# Altium schematic sheet Sheet1.SchDoc
size A3; SheetNumber: 1; SheetTotal: 1
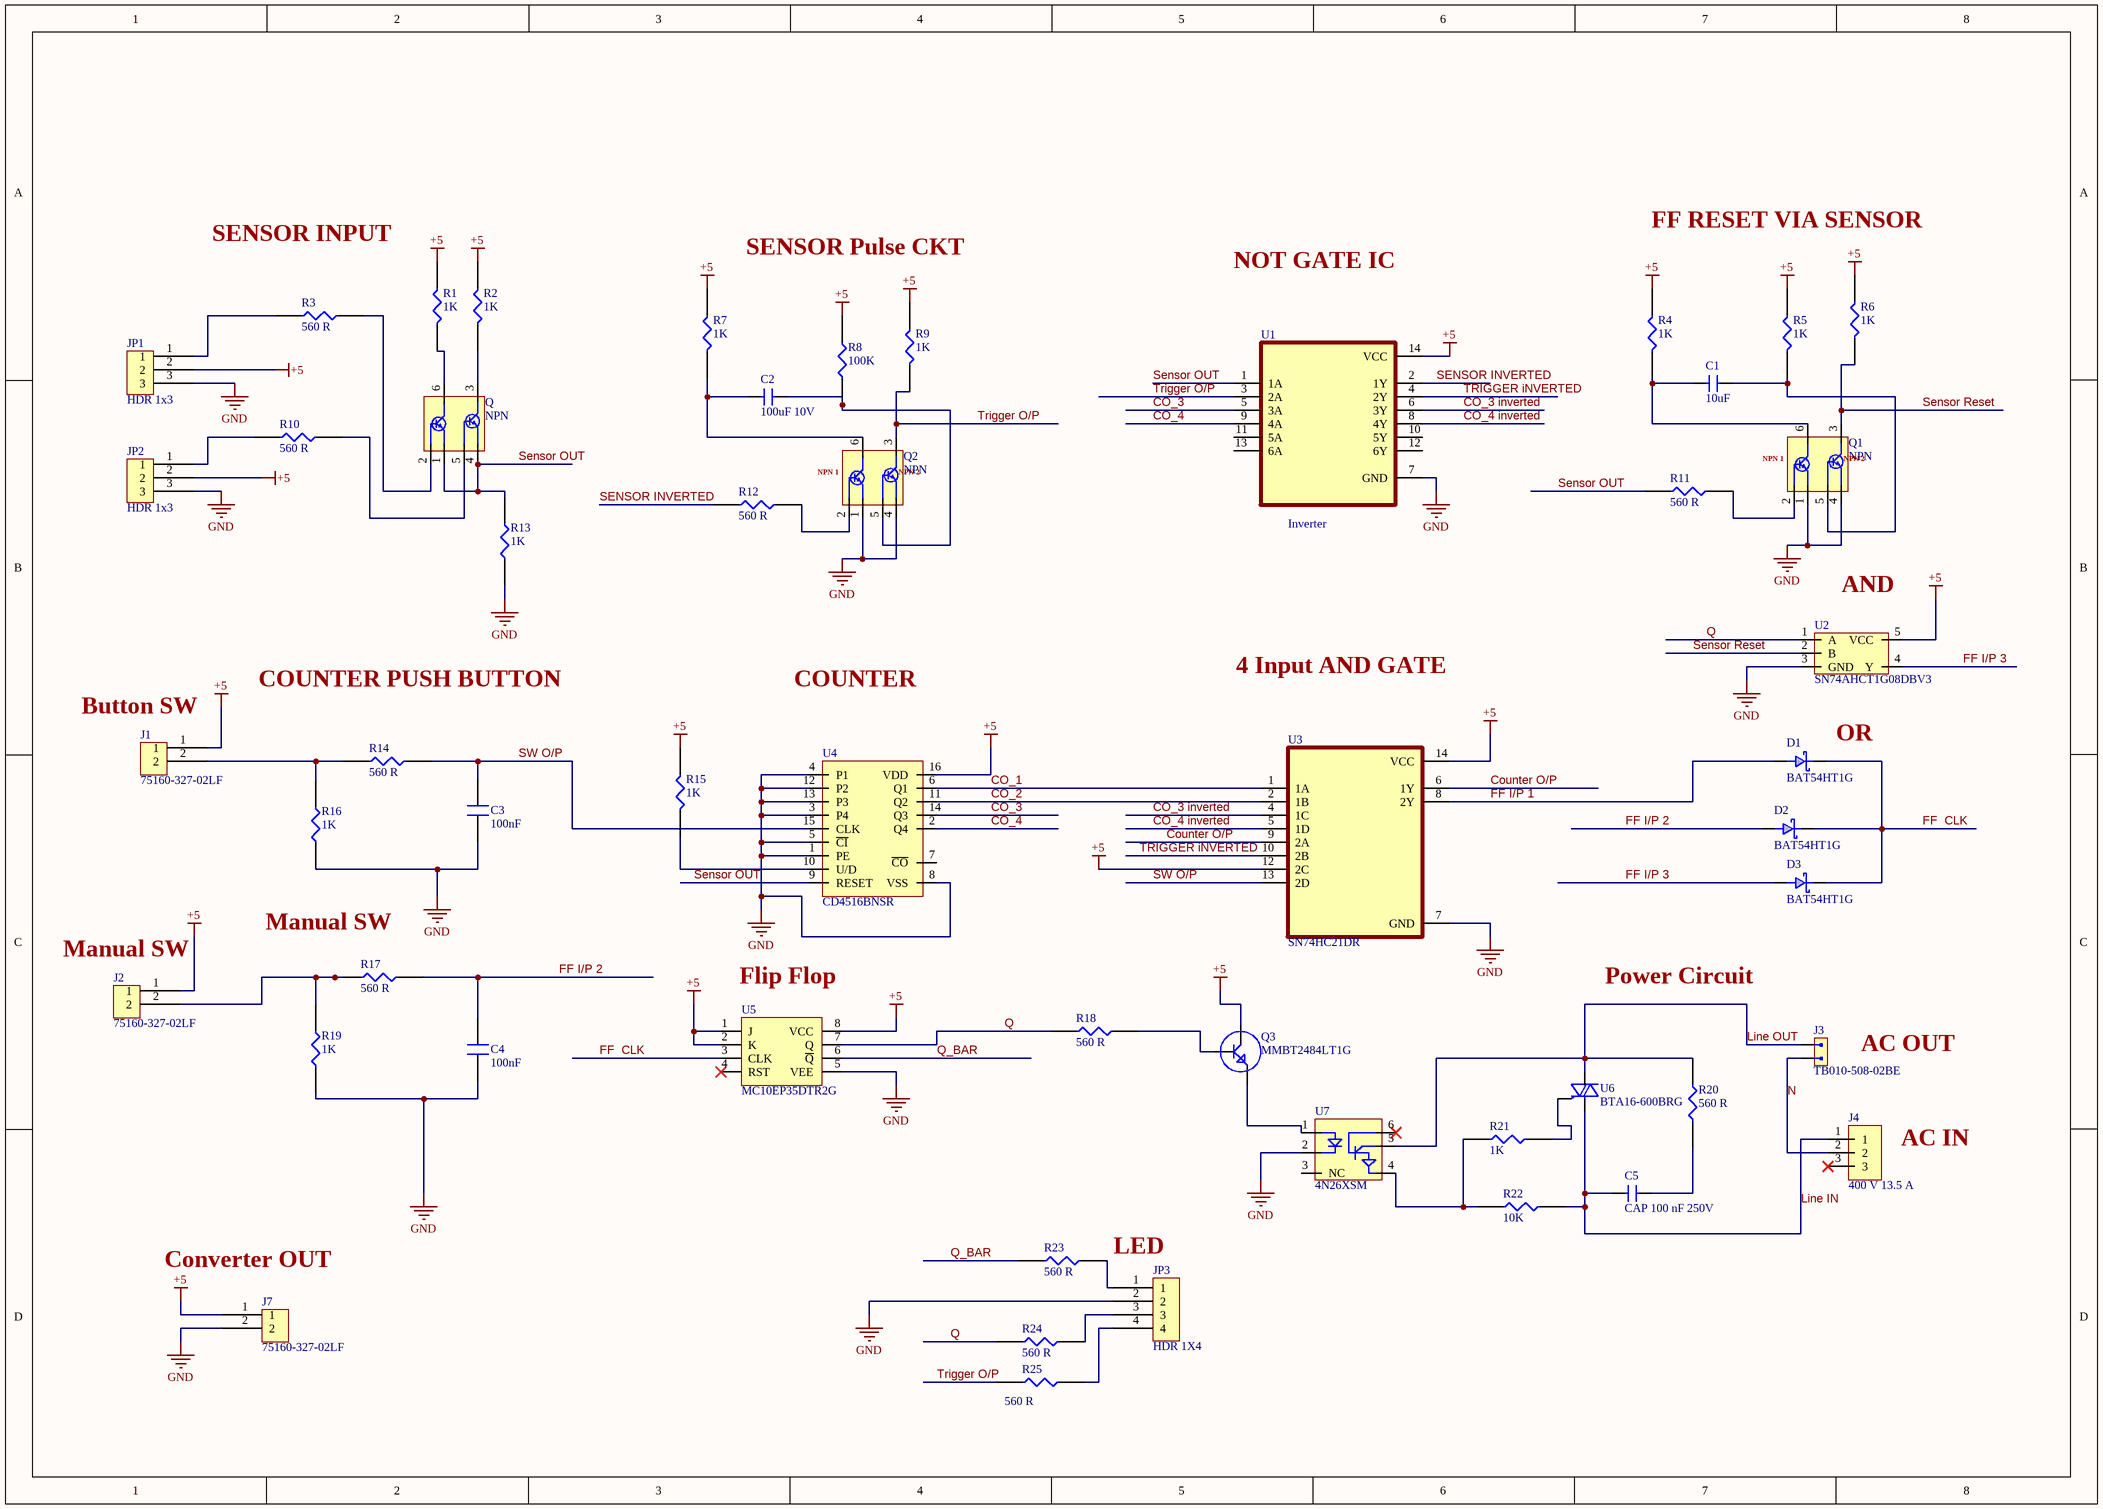
[diagram p0: Sheet1.SchDoc]

## Parts
C1  10uF  [CAP_0805]
C2  100uF 10V  [CAP3216]
C3  100nF  [CAP_0805]
C4  100nF  [CAP_0805]
C5  CAP 100 nF 250V  [CAP_0805]
D1  BAT54HT1G  [SOD323]
D2  BAT54HT1G  [SOD323]
D3  BAT54HT1G  [SOD323]
J1  75160-327-02LF  [HDR 1x2]
J2  75160-327-02LF  [HDR 1x2]
J3  TB010-508-02BE  [CUI_TB010-508-02BE]
J4  400 V 13.5 A  [Screw 5mm 3 Terminal]
J7  75160-327-02LF  [HDR 1x2]
JP1  HDR 1x3  [HDR 1x3]
JP2  HDR 1x3  [HDR 1x3]
JP3  HDR 1X4  [HDR 1X4]
Q  NPN  [SOT-363]
Q1  NPN  [SOT-363]
Q2  NPN  [SOT-363]
Q3  MMBT2484LT1G  [SOT23-3]
R1  1K  [R_0805]
R2  1K  [R_0805]
R3  560 R  [R_0805]
R4  1K  [R_0805]
R5  1K  [R_0805]
R6  1K  [R_0805]
R7  1K  [R_0805]
R8  100K  [R_0805]
R9  1K  [R_0805]
R10  560 R  [R_0805]
R11  560 R  [R_0805]
R12  560 R  [R_0805]
R13  1K  [R_0805]
R14  560 R  [R_0805]
R15  1K  [R_0805]
R16  1K  [R_0805]
R17  560 R  [R_0805]
R18  560 R  [R_0805]
R19  1K  [R_0805]
R20  560 R  [R_0805]
R21  1K  [R_0805]
R22  10K  [R_0805]
R23  560 R  [R_0805]
R24  560 R  [R_0805]
R25  560 R  [R_0805]
U1  Inverter  [14-TSSOP]
U2  SN74AHCT1G08DBV3  [SOT-23-5]
U3  SN74HC21DR  [SOIC 14]
U4  CD4516BNSR  [SOIC 16]
U5  MC10EP35DTR2G  [8-TSSOP]
U6  BTA16-600BRG  [BAT16]
U7  4N26XSM  [SMD 6]

## Nets
+5: J1.1 J2.1 J7.1 JP1.2 JP2.2 Q3.3 R1.2 R2.2 R4.2 R5.2 R6.2 R7.2 R8.2 R9.2 R15.2 U1.14(VCC) U2.5(VCC) U3.12(2C) U3.14(VCC) U4.16(VDD) U5.1(J) U5.2(K) U5.8(VCC)
GND: C3.2 C4.2 J7.2 JP1.3 JP2.3 JP3.2 Q1.1(E1) Q1.4(E2) Q2.1(E1) Q2.4(E2) R13.1 R16.2 R19.2 U1.7(GND) U2.3(GND) U3.7(GND) U4.1(PE) U4.3(P4) U4.4(P1) U4.5(~{CI}) U4.8(VSS) U4.12(P2) U4.13(P3) U5.5(VEE) U7.2
CO_1: U3.1(1A) U4.6(Q1)
CO_2: U3.2(1B) U4.11(Q2)
CO_3: U1.5(3A) U4.14(Q3)
CO_3 inverted: U1.6(3Y) U3.4(1C)
CO_4: U1.9(4A) U4.2(Q4)
CO_4 inverted: U1.8(4Y) U3.5(1D)
Counter O/P: U3.6(1Y) U3.9(2A)
FF  CLK: D1.1(Cathode) D2.1(Cathode) D3.1(Cathode) U5.3(CLK)
FF I/P 1: D1.2(Anode) U3.8(2Y)
FF I/P 2: C4.1 D2.2(Anode) R17.2
FF I/P 3: D3.2(Anode) U2.4(Y)
Line IN: C5.1 J4.1 R22.2 U6.1(A1)
Line OUT: J3.1 R20.2 U6.2(A2) U7.5
N: J3.2 J4.2
Q: R18.1 R24.1 U2.1(A) U5.7(Q)
Q_BAR: R23.1 U5.6(~{Q})
SENSOR INVERTED: R12.1 U1.2(1Y)
Sensor OUT: Q.1(E1) Q.4(E2) R11.1 R13.2 U1.1(1A) U4.9(RESET)
Sensor Reset: Q1.3(C2) R6.1 U2.2(B)
SW O/P: C3.1 R14.2 U3.13(2D) U4.15(CLK)
TRIGGER iNVERTED: U1.4(2Y) U3.10(2B)
Trigger O/P: Q2.3(C2) R9.1 R25.1 U1.3(2A)
NetC1_1: C1.1 Q1.6(C1) R4.1
NetC1_2: C1.2 Q1.5(B2) R5.1
NetC2_1: C2.1 Q2.6(C1) R7.1
NetC2_2: C2.2 Q2.5(B2) R8.1
NetC5_2: C5.2 R20.1
NetJ1_2: J1.2 R14.1 R16.1
NetJ2_2: J2.2 R17.1 R19.1
NetJP1_1: JP1.1 R3.1
NetJP2_1: JP2.1 R10.1
NetJP3_1: JP3.1 R23.2
NetJP3_3: JP3.3 R24.2
NetJP3_4: JP3.4 R25.2
NetQ1_2: Q1.2(B1) R11.2
NetQ2_2: Q2.2(B1) R12.2
NetQ3_1: Q3.1 R18.2
NetQ3_2: Q3.2 U7.1
NetQ_2: Q.2(B1) R3.2
NetQ_3: Q.3(C2) R2.1
NetQ_5: Q.5(B2) R10.2
NetQ_6: Q.6(C1) R1.1
NetR15_1: R15.1 U4.10(U/D)
NetR21_1: R21.1 R22.1 U7.4
NetR21_2: R21.2 U6.3(G)

Not connected (* = marked no-connect by the designer): J4 3*; U1 10(5Y) 11(5A) 12(6Y) 13(6A); U4 7(~{CO}); U5 4(RST)*; U7 3(NC) 6*

## Notes on the sheet
- SENSOR INPUT
- FF RESET VIA SENSOR
- SENSOR Pulse CKT
- NOT GATE IC
- (near Q2) NPN 1
- (near Q2) NPN 2
- (near Q1) NPN 1
- (near Q1) NPN 2
- (near U2) AND
- (near J1) Button SW
- COUNTER PUSH BUTTON
- COUNTER
- 4 Input AND GATE
- (near D1) OR
- (near J2) Manual SW
- (near R17) Manual SW
- (near U5) Flip Flop
- Power Circuit
- AC OUT
- (near J4) AC IN
- LED
- (near J7) Converter OUT

## Library data of the parts
C1 = CAP_10uF_0805: CERAMIC CAPACITOR, 10UF, 16V, X5R, 20%, 0805, FULL REEL; Product Range:C Series; Capacitance:10 F; Capacitance Tolerance: 20%; Dielectric Characteristic:X5R; Voltage Rating:16V; Ceramic Capacitor Case:0805 [2012 Metric]; MSL:- ;RoHS Compliant: Yes; Manufacturer: TDK; Manufacturer Part Number: C2012X5R1C106M125AC; Supplier 1: Digi-Key; RoHS: Yes; Category: Ceramic Capacitors; Mount: Surface Mount; Case/Package: 0805; Number of Pins: 2; Case Code (Metric): 2012; Case Code (Imperial): 0805; Dielectric Material: Ceramic; Weight: 0.000194oz; Min Operating Temperature: -55°C; Max Operating Temperature: 85°C; Capacitance: 10uF; Tolerance: 20%; Voltage Rating: 16V; Packaging: Tape and Reel; Voltage Rating (DC): 16V; Dielectric: X5R; Termination: SMD/SMT; Package Quantity: 1; Resistor Type: Ceramic; Series: C; Length: 0.079inch; Width: 0.049inch; Height: 1.25mm; Depth: 1.25mm; Thickness: 0.057inch; RoHS Compliant: Yes; REACH SVHC: No SVHC; Lead Free: Lead Free; ComponentLink1URL: https://datasheet.ciiva.com/6289/tdkmlcccaprange-6289238.pdf?src-supplier=Digi-Key; ComponentLink1Description: https://datasheet.ciiva.com/6289/tdkmlcccaprange-6289238.pdf?src-supplier=Digi-Key; ComponentLink2URL: https://datasheet.ciiva.com/22725/1913358-22725558.pdf?src-supplier=Element14; ComponentLink2Description: https://datasheet.ciiva.com/22725/1913358-22725558.pdf?src-supplier=Element14; ComponentLink3URL: https://datasheet.ciiva.com/6252/tdkmlcccaprange-6252105.pdf?src-supplier=Digi-Key; ComponentLink3Description: https://datasheet.ciiva.com/6252/tdkmlcccaprange-6252105.pdf?src-supplier=Digi-Key; ComponentLink4URL: https://datasheet.ciiva.com/6252/tdkmlcccaprange-6252108.pdf?src-supplier=Digi-Key; ComponentLink4Description: https://datasheet.ciiva.com/6252/tdkmlcccaprange-6252108.pdf?src-supplier=Digi-Key; ComponentLink5URL: https://datasheet.ciiva.com/23803/1796654-23803022.pdf?src-supplier=Newark; ComponentLink5Description: https://datasheet.ciiva.com/23803/1796654-23803022.pdf?src-supplier=Newark; Supplier Part Number 1: 445-4115-1-ND
C2 = CAP 100 uF SMD Non Polar: C Series 1206 100 uF 10 V ±20 % Tolerance JB SMT Multilayer Ceramic Capacitor; Manufacturer: TDK; Manufacturer Part Number: C3216JB1A107M160AC; Tolerance: 20%; Supplier 1: Arrow Electronics; RoHS: Yes; Category: Ceramic Capacitors; Stock 1: 129; Pricing 1: 1=1.26370, 10=0.99660, 25=0.98660, 50=0.92240, 100=0.76590 (USD); Mount: Surface Mount; Case/Package: 1206; Case Code (Metric): 3216; Case Code (Imperial): 1206; Dielectric Material: Ceramic; Min Operating Temperature: -25°C; Max Operating Temperature: 85°C; Package Quantity: 2000; Packaging: Tape and Reel; Capacitance: 100uF; Voltage Rating: 10V; Termination: SMD/SMT; Resistor Type: Ceramic; Voltage Rating (DC): 10V; Series: C; Length: 0.126inch; Width: 0.063inch; Height: 1.6mm; Thickness: 0.069inch; Lead Free: Lead Free; RoHS Compliant: Yes; ComponentLink1URL: https://datasheet.ciiva.com/14887/tdkmlcccaprange-14887077.pdf?src-supplier=Digi-Key; ComponentLink1Description: https://datasheet.ciiva.com/14887/tdkmlcccaprange-14887077.pdf?src-supplier=Digi-Key; ComponentLink2URL: https://datasheet.ciiva.com/14887/tdkmlcccaprange-14887078.pdf?src-supplier=Digi-Key; ComponentLink2Description: https://datasheet.ciiva.com/14887/tdkmlcccaprange-14887078.pdf?src-supplier=Digi-Key; ComponentLink3URL: https://datasheet.ciiva.com/14887/tdkmlcccaprange-14887079.pdf?src-supplier=Digi-Key; ComponentLink3Description: https://datasheet.ciiva.com/14887/tdkmlcccaprange-14887079.pdf?src-supplier=Digi-Key; Supplier Part Number 1: C3216JB1A107M160AC
C3 C4 = CAP_100nF_0805: C Series 0805 0.1 uF 50 V ±10 % Tolerance X7R SMT Multilayer Ceramic Capacitor; Manufacturer: TDK; Manufacturer Part Number: C2012X7R1H104K085AA; Voltage Rating: 50V; Tolerance: 10%; Supplier 1: Avnet; RoHS: Yes; Category: Ceramic Capacitors; Stock 1: 16000; Pricing 1: 4000=0.02500, 8000=0.02400 (USD); Mount: Surface Mount; Case/Package: 0805; Number of Pins: 2; Case Code (Metric): 2012; Case Code (Imperial): 0805; Weight: 0.000194oz; Dielectric Material: Ceramic; Min Operating Temperature: -55°C; Max Operating Temperature: 125°C; Capacitance: 100nF; Packaging: Tape and Reel; Voltage Rating (DC): 50V; Dielectric: X7R; Termination: SMD/SMT; Construction: Flat; Package Quantity: 1; Resistor Type: Ceramic; Voltage: 50V; Series: C; Length: 2mm; Width: 0.049inch; Height: 0.85mm; Depth: 1.25mm; Thickness: 0.037inch; Radiation Hardening: No; RoHS Compliant: Yes; REACH SVHC: No SVHC; Lead Free: Lead Free; ComponentLink1URL: https://datasheet.ciiva.com/11788/0900766b80c1bb00-11788128.pdf?src-supplier=RSComponents; ComponentLink1Description: https://datasheet.ciiva.com/11788/0900766b80c1bb00-11788128.pdf?src-supplier=RSComponents; ComponentLink2URL: https://datasheet.ciiva.com/6250/tdkmlcccaprange-6250821.pdf?src-supplier=Digi-Key; ComponentLink2Description: https://datasheet.ciiva.com/6250/tdkmlcccaprange-6250821.pdf?src-supplier=Digi-Key; ComponentLink3URL: https://datasheet.ciiva.com/24191/e412-c-24191447.pdf?src-supplier=Future+Electronics; ComponentLink3Description: https://datasheet.ciiva.com/24191/e412-c-24191447.pdf?src-supplier=Future+Electronics; ComponentLink4URL: https://datasheet.ciiva.com/6250/tdkmlcccaprange-6250824.pdf?src-supplier=Digi-Key; ComponentLink4Description: https://datasheet.ciiva.com/6250/tdkmlcccaprange-6250824.pdf?src-supplier=Digi-Key; ComponentLink5URL: https://datasheet.ciiva.com/23803/1796654-23803035.pdf?src-supplier=Newark; ComponentLink5Description: https://datasheet.ciiva.com/23803/1796654-23803035.pdf?src-supplier=Newark; ComponentLink6URL: https://datasheet.ciiva.com/28602/1571323-28602204.pdf?src-supplier=Element14; ComponentLink6Description: https://datasheet.ciiva.com/28602/1571323-28602204.pdf?src-supplier=Element14; Supplier Part Number 1: 87R4037
C5 = CAP 100 nF 250V: C Series 0805 0.1 uF 250 V ±20 % Tolerance X7T SMT Multilayer Ceramic Capacitor
D1-D3 = Shottky_Diode: VR=30V IF=200mA 10pF P=200mW; Manufacturer: ON Semiconductor / Fairchild; Forward Voltage: 800mV; Forward Current: 200mA; Recovery Time: 5ns; Max Repetitive Reverse Voltage (Vrrm): 30V; Peak Non-Repetitive Surge Current: 600mA; Element Configuration: Single; Max Reverse Current: 2uA; Power Dissipation: 200mW; Polarity: Standard; Supplier 1: Newark; Manufacturer Part Number: BAT54HT1G; RoHS: Yes; Category: Schottky Diodes; Stock 1: 15000; Pricing 1: 1=0.32000, 10=0.22600, 100=0.12200, 500=0.09600 (USD); Mount: Surface Mount; Number of Pins: 2; Contact Plating: Tin,Matte; Min Operating Temperature: -55°C; Max Operating Temperature: 150°C; Packaging: Tape and Reel; Package Quantity: 3000; Average Rectified Current: 200mA; Reverse Recovery Time: 5ns; Max Forward Surge Current (Ifsm): 600mA; Max Reverse Voltage (DC): 30V; Max Surge Current: 600mA; Voltage Rating (DC): 30V; Current Rating: 200mA; Capacitance: 10pF; Output Current: 200mA; Reverse Voltage: 30V; Max Reverse Leakage Current: 2uA; Length: 1.8mm; Width: 1.35mm; Height: 1mm; Radiation Hardening: No; Lead Free: Lead Free; REACH SVHC: No SVHC; RoHS Compliant: Yes; ComponentLink1URL: https://datasheet.ciiva.com/4714/bat54ht1-d-72881-4714706.pdf?src-supplier=Mouser; ComponentLink1Description: https://datasheet.ciiva.com/4714/bat54ht1-d-72881-4714706.pdf?src-supplier=Mouser; ComponentLink2URL: https://datasheet.ciiva.com/4452/bat54ht1g-104602-4452889.pdf?src-supplier=Mouser; ComponentLink2Description: https://datasheet.ciiva.com/4452/bat54ht1g-104602-4452889.pdf?src-supplier=Mouser; ComponentLink3URL: https://datasheet.ciiva.com/30479/0900766b811a63a9-30479442.pdf?src-supplier=RSComponents; ComponentLink3Description: https://datasheet.ciiva.com/30479/0900766b811a63a9-30479442.pdf?src-supplier=RSComponents; ComponentLink4URL: https://datasheet.ciiva.com/34301/806549-34301562.pdf?src-supplier=Jameco; ComponentLink4Description: https://datasheet.ciiva.com/34301/806549-34301562.pdf?src-supplier=Jameco; ComponentLink5URL: https://datasheet.ciiva.com/1240/1747983-1240762.pdf?src-supplier=Newark; ComponentLink5Description: https://datasheet.ciiva.com/1240/1747983-1240762.pdf?src-supplier=Newark; ComponentLink6URL: https://datasheet.ciiva.com/915/bat54ht1-d-915445.pdf?src-supplier=Digi-Key; ComponentLink6Description: https://datasheet.ciiva.com/915/bat54ht1-d-915445.pdf?src-supplier=Digi-Key; ComponentLink7URL: https://datasheet.ciiva.com/915/bat54ht1-d-915444.pdf?src-supplier=Digi-Key; ComponentLink7Description: https://datasheet.ciiva.com/915/bat54ht1-d-915444.pdf?src-supplier=Digi-Key; ComponentLink8URL: https://datasheet.ciiva.com/910/bat54ht1g-910499.pdf?src-supplier=Digi-Key; ComponentLink8Description: https://datasheet.ciiva.com/910/bat54ht1g-910499.pdf?src-supplier=Digi-Key; ComponentLink9URL: https://datasheet.ciiva.com/910/bat54ht1g-910498.pdf?src-supplier=Digi-Key; ComponentLink9Description: https://datasheet.ciiva.com/910/bat54ht1g-910498.pdf?src-supplier=Digi-Key; ComponentLink10URL: https://datasheet.ciiva.com/8294/bat54ht1-d-8294645.pdf?src-supplier=Avnet; ComponentLink10Description: https://datasheet.ciiva.com/8294/bat54ht1-d-8294645.pdf?src-supplier=Avnet; ComponentLink11URL: https://datasheet.ciiva.com/910/bat54ht1g-910497.pdf?src-supplier=Digi-Key; ComponentLink11Description: https://datasheet.ciiva.com/910/bat54ht1g-910497.pdf?src-supplier=Digi-Key; ComponentLink12URL: https://datasheet.ciiva.com/8303/bat54ht1g-8303645.pdf?src-supplier=Avnet; ComponentLink12Description: https://datasheet.ciiva.com/8303/bat54ht1g-8303645.pdf?src-supplier=Avnet; ComponentLink13URL: https://datasheet.ciiva.com/915/bat54ht1-d-915443.pdf?src-supplier=Digi-Key; ComponentLink13Description: https://datasheet.ciiva.com/915/bat54ht1-d-915443.pdf?src-supplier=Digi-Key; ComponentLink14URL: https://datasheet.ciiva.com/46429/1727620-46429206.pdf?src-supplier=Element14; ComponentLink14Description: https://datasheet.ciiva.com/46429/1727620-46429206.pdf?src-supplier=Element14; ComponentLink15URL: https://datasheet.ciiva.com/1180/bat54ht1-d-1180252.pdf?src-supplier=Element14; ComponentLink15Description: https://datasheet.ciiva.com/1180/bat54ht1-d-1180252.pdf?src-supplier=Element14; ComponentLink16URL: https://datasheet.ciiva.com/1180/bat54ht1-d-1180251.pdf?src-supplier=Element14; ComponentLink16Description: https://datasheet.ciiva.com/1180/bat54ht1-d-1180251.pdf?src-supplier=Element14; ComponentLink17URL: https://datasheet.ciiva.com/17020/bat54ht1g-17020445.pdf?src-supplier=Future+Electronics; ComponentLink17Description: https://datasheet.ciiva.com/17020/bat54ht1g-17020445.pdf?src-supplier=Future+Electronics; ComponentLink18URL: https://datasheet.ciiva.com/48686/001262925-da-01-en-diode-schottky-30v-bat54ht1g-sod-323-fsc-48686266.pdf?src-supplier=Conrad; ComponentLink18Description: https://datasheet.ciiva.com/48686/001262925-da-01-en-diode-schottky-30v-bat54ht1g-sod-323-fsc-48686266.pdf?src-supplier=Conrad; Supplier Part Number 1: 83H6419
J1 J2 J7 = MALE_HDR_1X2: Conn Unshrouded Header HDR 2 POS 2.54mm Solder ST Thru-Hole Poly Bag; Manufacturer: Amphenol ICC / FCI; Supplier 1: Avnet; Manufacturer Part Number: 75160-327-02LF; RoHS: Yes; Category: Connectors; Pricing 1: 100=0.09225, 200=0.08985, 400=0.08745, 600=0.08506, 800=0.08266, 1000=0.08027, 10000=0.07787 (USD); ComponentLink1URL: https://datasheet.ciiva.com/10145/75160-10145737.pdf?src-supplier=Avnet; ComponentLink1Description: https://datasheet.ciiva.com/10145/75160-10145737.pdf?src-supplier=Avnet; ComponentLink2URL: https://datasheet.ciiva.com/13670/75160-99052-13670687.pdf?src-supplier=Mouser; ComponentLink2Description: https://datasheet.ciiva.com/13670/75160-99052-13670687.pdf?src-supplier=Mouser; Supplier Part Number 1: 75160-327-02LF
J3 = Screw terminal 2 pin: 2~24 Poles, Screw Type, Horizontal, 5.08 Pitch, 26~12 (AWG), Terminal Block Connector; Manufacturer: CUI Devices; Supplier 1: Arrow Electronics; Manufacturer Part Number: TB010-508-02BE; RoHS: Yes; Category: Terminal Blocks; Stock 1: 2322; Pricing 1: 1=0.80810, 10=0.41960, 25=0.41540, 50=0.41120, 100=0.35430, 250=0.35070, 500=0.32260 (USD); Supplier Part Number 1: TB010-508-02BE
J4 = Screw Terminal HV 3 pins: Phoenix Contact 5441540, BC-500X10- 3 BK PCB terminal blo; Number of Levels: 1; Number of Positions Per Level: 3; Current: 10A; Voltage: 300V; Pitch: 0.197inch; Wire Gauge (Max): 30AWG; Wire Gauge (Min): 14AWG; Supplier 1: Mouser; Manufacturer: Phoenix Contact; Manufacturer Part Number: 5441540; RoHS: Yes; Category: Terminal Blocks; Stock 1: 78; Pricing 1: 1=1.75000, 10=1.68000, 50=1.63000, 100=1.52000, 1000=1.24000, 10000=1.16000 (USD); Mount: Through Hole; Housing Material: Nylon; Color: Black; Packaging: Bulk; Termination: Screw; ComponentLink1URL: https://media.digikey.com/pdf/Data%20Sheets/Phoenix%20Contact%20PDFs/5441540.pdf?src-supplier=Digi-Key; ComponentLink1Description: https://media.digikey.com/pdf/Data%20Sheets/Phoenix%20Contact%20PDFs/5441540.pdf?src-supplier=Digi-Key; Supplier Part Number 1: 651-5441540
JP1 JP2 = Male_HDR_1X3_Unschrouded: Conn Unshrouded Header HDR 3 POS 2.54mm Solder ST Top Entry Thru-Hole BergStik® Bulk; Manufacturer: Amphenol ICC / FCI; Manufacturer Part Number: 68797-403HLF; Supplier 1: Mouser; RoHS: Yes; Category: Headers and Wire Housings; Stock 1: 8712; Pricing 1: 1=0.26000, 10=0.18500, 50=0.18500, 100=0.14600, 1000=0.11800, 2000=0.10500, 10000=0.09500, 25000=0.08900, 50000=0.08500, 100000=0.08200 (USD); ComponentLink1URL: http://components.arrow.com/part/dataview/42734829S8484744N8314?src-supplier=Arrow+Electronics; ComponentLink1Description: http://components.arrow.com/part/dataview/42734829S8484744N8314?src-supplier=Arrow+Electronics; ComponentLink2URL: http://www.mouser.com/ds/2/154/68000-274373.pdf?src-supplier=Mouser; ComponentLink2Description: http://www.mouser.com/ds/2/154/68000-274373.pdf?src-supplier=Mouser; ComponentLink3URL: http://portal.fciconnect.com/Comergent/fci/drawing/68000.pdf?src-supplier=Avnet; ComponentLink3Description: http://portal.fciconnect.com/Comergent/fci/drawing/68000.pdf?src-supplier=Avnet; Supplier Part Number 1: 649-68797-403HLF
JP3 = MALE_HDR_4X1_Unschrouded: Conn Unshrouded Header HDR 4 POS 2.54mm Solder ST Thru-Hole Bag; Manufacturer: Amphenol ICC; Manufacturer Part Number: 68001-204HLF; Supplier 1: Allied Electronics; RoHS: Yes; Category: Headers and Wire Housings; ComponentLink1URL: http://www.farnell.com/cad/2615197.pdf?src-supplier=Farnell; ComponentLink1Description: http://www.farnell.com/cad/2615197.pdf?src-supplier=Farnell; ComponentLink2URL: http://www.farnell.com/cad/2615197.pdf?src-supplier=Newark; ComponentLink2Description: http://www.farnell.com/cad/2615197.pdf?src-supplier=Newark; Supplier Part Number 1: 70302499
Q Q1 Q2 = NPN SMD 2 CKT: 三极管 2NPN Vceo=40V Ic=200mA Pd=225mW; Manufacturer: Pan Jit; Manufacturer Part Number: MMDT3904_R1_00001; Supplier 1: Digi-Key; RoHS: No; Stock 1: 42118; Pricing 1: 1=0.23000, 10=0.18500, 100=0.09790, 500=0.06440, 1000=0.04379 (USD); Supplier Part Number 1: 3757-MMDT3904_R1_00001CT-ND
Q3 = BJT SMD: Transistor Bipolar (BJT) NPN 60V 100mA 225mW Surface Mount SOT-23-3; Manufacturer: ON Semiconductor; hFE Min: 250; Number of Elements: 1; Emitter Base Voltage (VEBO): 6V; Collector Emitter Saturation Voltage: 350mV; Power Dissipation: 300mW; Element Configuration: Single; Max Frequency: 1MHz; Supplier 1: RSComponents; Manufacturer Part Number: MMBT2484LT1G; RoHS: Yes; Category: BJTs; Stock 1: 1; Pricing 1: 100=0.12200, 200=0.10100, 500=0.08000, 1000=0.05500 (USD); Case/Package: SOT-23-3; Number of Pins: 3; Contact Plating: Tin,Matte; Min Operating Temperature: -55°C; Max Operating Temperature: 150°C; Package Quantity: 1; Collector Emitter Voltage (VCEO): 60V; Max Power Dissipation: 225mW; Packaging: Tape and Reel; Max Collector Current: 100mA; Polarity: NPN; Collector Base Voltage (VCBO): 60V; Collector Emitter Breakdown Voltage: 60V; Max Breakdown Voltage: 60V; Voltage Rating (DC): 60V; Current Rating: 100mA; Series: -; Collector-emitter Voltage-Max: 350mV; Length: 3.04mm; Width: 1.4mm; Height: 1.01mm; Radiation Hardening: No; REACH SVHC: No SVHC; Lead Free: Lead Free; RoHS Compliant: Yes; ComponentLink1URL: https://datasheet.ciiva.com/976/mmbt2484lt1-d-976544.pdf?src-supplier=Digi-Key; ComponentLink1Description: https://datasheet.ciiva.com/976/mmbt2484lt1-d-976544.pdf?src-supplier=Digi-Key; ComponentLink2URL: https://datasheet.ciiva.com/4721/mmbt2484lt1-d-95150-4721744.pdf?src-supplier=Mouser; ComponentLink2Description: https://datasheet.ciiva.com/4721/mmbt2484lt1-d-95150-4721744.pdf?src-supplier=Mouser; ComponentLink3URL: https://datasheet.ciiva.com/11201/mmbt2484lt1-d-11201761.pdf?src-supplier=Avnet; ComponentLink3Description: https://datasheet.ciiva.com/11201/mmbt2484lt1-d-11201761.pdf?src-supplier=Avnet; ComponentLink4URL: https://datasheet.ciiva.com/30480/0900766b8127ca68-30480445.pdf?src-supplier=RSComponents; ComponentLink4Description: https://datasheet.ciiva.com/30480/0900766b8127ca68-30480445.pdf?src-supplier=RSComponents; ComponentLink5URL: https://datasheet.ciiva.com/15138/getdatasheetpartid-38721-15138638.pdf?src-supplier=Verical; ComponentLink5Description: https://datasheet.ciiva.com/15138/getdatasheetpartid-38721-15138638.pdf?src-supplier=Verical; ComponentLink6URL: https://datasheet.ciiva.com/976/mmbt2484lt1-d-976545.pdf?src-supplier=Digi-Key; ComponentLink6Description: https://datasheet.ciiva.com/976/mmbt2484lt1-d-976545.pdf?src-supplier=Digi-Key; ComponentLink7URL: https://datasheet.ciiva.com/976/mmbt2484lt1-d-976546.pdf?src-supplier=Digi-Key; ComponentLink7Description: https://datasheet.ciiva.com/976/mmbt2484lt1-d-976546.pdf?src-supplier=Digi-Key; ComponentLink8URL: https://datasheet.ciiva.com/7972/mmbt2484lt1-d-7972373.pdf?src-supplier=Element14; ComponentLink8Description: https://datasheet.ciiva.com/7972/mmbt2484lt1-d-7972373.pdf?src-supplier=Element14; Supplier Part Number 1: 7916126P
R1 R2 R4-R7 R9 R13 R15 R16 R19 R21 = RES_1_K_0805: 贴片电阻 1000Ω ± 1.00% 0.125W ± 100ppm/℃ 0805; Manufacturer: Yageo; Manufacturer Part Number: RC0805FR-071KL; Tolerance: 1%; Resistance: 1kR; Temperature Coefficient: 100ppm/°C; Voltage Rating (DC): 150V; Power Rating: 125mW; Supplier 1: Future Electronics; RoHS: Yes; Category: Chip SMD Resistors; Stock 1: 10195000; Pricing 1: 5000=0.00390 (USD); Case/Package: 0805; Number of Pins: 2; Case Code (Metric): 2012; Case Code (Imperial): 0805; Size Code: 0805; Min Operating Temperature: -55°C; Max Operating Temperature: 155°C; Packaging: Tape and Reel; Resistor Type: Thick Film; Package Quantity: 1; Voltage Rating: 150V; Number of Terminations: 2; Termination: SMD/SMT; Max Power Dissipation: 125mW; Features: Moisture Resistant; Series: RC; Resistance Tolerance: 1%; Construction: Rectangular; Length: 0.079inch; Width: 0.049inch; Height: 0.024inch; Depth: 1.25mm; REACH SVHC: Unknown; Lead Free: Lead Free; RoHS Compliant: Yes; Military Standard: Not; ComponentLink1URL: https://datasheet.ciiva.com/7941/1686128-7941719.pdf?src-supplier=Element14; ComponentLink1Description: https://datasheet.ciiva.com/7941/1686128-7941719.pdf?src-supplier=Element14; ComponentLink2URL: https://datasheet.ciiva.com/46385/444164-46385020.pdf?src-supplier=Element14; ComponentLink2Description: https://datasheet.ciiva.com/46385/444164-46385020.pdf?src-supplier=Element14; ComponentLink3URL: https://datasheet.ciiva.com/2456/pyu-r-int-thick-7-2456976.pdf?src-supplier=Digi-Key; ComponentLink3Description: https://datasheet.ciiva.com/2456/pyu-r-int-thick-7-2456976.pdf?src-supplier=Digi-Key; ComponentLink4URL: https://datasheet.ciiva.com/2456/pyu-r-int-thick-7-2456977.pdf?src-supplier=Digi-Key; ComponentLink4Description: https://datasheet.ciiva.com/2456/pyu-r-int-thick-7-2456977.pdf?src-supplier=Digi-Key; ComponentLink5URL: https://datasheet.ciiva.com/2456/pyu-r-int-thick-7-2456975.pdf?src-supplier=Digi-Key; ComponentLink5Description: https://datasheet.ciiva.com/2456/pyu-r-int-thick-7-2456975.pdf?src-supplier=Digi-Key; ComponentLink6URL: https://datasheet.ciiva.com/16850/rc0805-16850409.pdf?src-supplier=Future+Electronics; ComponentLink6Description: https://datasheet.ciiva.com/16850/rc0805-16850409.pdf?src-supplier=Future+Electronics; Supplier Part Number 1: 8126013
R3 R10-R12 R14 R17 R18 R20 R23-R25 = RES_560_Ohm_0805: 贴片电阻 560Ω ± 1.00% 0.125W ± 100ppm/℃ 0805; Manufacturer: Yageo; Manufacturer Part Number: RC0805FR-07560RL; Tolerance: 1%; Resistance: 560R; Temperature Coefficient: 100ppm/°C; Power Rating: 125mW; Voltage Rating: 150V; Supplier 1: Avnet; RoHS: Yes; Category: Chip SMD Resistors; Stock 1: 5000; Pricing 1: 5000=0.00227, 10000=0.00224, 20000=0.00217 (USD); Case/Package: 0805; Case Code (Metric): 2012; Case Code (Imperial): 0805; Weight: 0.000194oz; Size Code: 0805; Min Operating Temperature: -55°C; Max Operating Temperature: 155°C; Packaging: Tape and Reel; Resistor Type: Thick Film; Package Quantity: 1; Number of Terminations: 2; Termination: SMD/SMT; Max Power Dissipation: 125mW; Features: Moisture Resistant; Series: RC; Resistance Tolerance: 1%; Construction: Rectangular; Length: 2mm; Width: 0.049inch; Height: 0.024inch; Depth: 1.25mm; REACH SVHC: Unknown; Lead Free: Lead Free; RoHS Compliant: Yes; Military Standard: Not; Supplier Part Number 1: RC0805FR-07560RL
R8 = RES_100_K_0805: 贴片电阻 100000Ω ± 1.00% 0.125W ± 100ppm/℃ 0805; Manufacturer: Yageo; Manufacturer Part Number: RC0805FR-07100KL; Tolerance: 1%; Resistance: 100kR; Power Rating: 125mW; Voltage Rating (DC): 150V; Temperature Coefficient: 100ppm/°C; Supplier 1: Avnet; RoHS: Yes; Category: Chip SMD Resistors; Stock 1: 345000; Pricing 1: 5000=0.00227, 10000=0.00224, 20000=0.00217 (USD); Case/Package: 0805; Number of Pins: 2; Case Code (Metric): 2012; Case Code (Imperial): 0805; Size Code: 0805; Min Operating Temperature: -55°C; Max Operating Temperature: 155°C; Resistor Type: Thick Film; Packaging: Tape and Reel; Voltage Rating: 150V; Package Quantity: 1; Number of Terminations: 2; Termination: SMD/SMT; Max Power Dissipation: 125mW; Features: Moisture Resistant; Series: RC; Construction: Rectangular; Resistance Tolerance: 1%; Technology: THICK FILM; Length: 2mm; Width: 0.049inch; Height: 0.024inch; Depth: 1.25mm; Lead Pitch: 0.4mm; REACH SVHC: Unknown; Lead Free: Lead Free; RoHS Compliant: Yes; Military Standard: Not; ComponentLink1URL: https://datasheet.ciiva.com/11808/0900766b8106beab-11808858.pdf?src-supplier=RSComponents; ComponentLink1Description: https://datasheet.ciiva.com/11808/0900766b8106beab-11808858.pdf?src-supplier=RSComponents; ComponentLink2URL: https://datasheet.ciiva.com/7941/1686128-7941677.pdf?src-supplier=Element14; ComponentLink2Description: https://datasheet.ciiva.com/7941/1686128-7941677.pdf?src-supplier=Element14; ComponentLink3URL: https://datasheet.ciiva.com/7660/38627-7660796.pdf?src-supplier=Element14; ComponentLink3Description: https://datasheet.ciiva.com/7660/38627-7660796.pdf?src-supplier=Element14; ComponentLink4URL: https://datasheet.ciiva.com/22747/444164-22747534.pdf?src-supplier=Element14; ComponentLink4Description: https://datasheet.ciiva.com/22747/444164-22747534.pdf?src-supplier=Element14; ComponentLink5URL: https://datasheet.ciiva.com/2457/pyu-r-int-thick-7-2457018.pdf?src-supplier=Digi-Key; ComponentLink5Description: https://datasheet.ciiva.com/2457/pyu-r-int-thick-7-2457018.pdf?src-supplier=Digi-Key; ComponentLink6URL: https://datasheet.ciiva.com/2457/pyu-r-int-thick-7-2457019.pdf?src-supplier=Digi-Key; ComponentLink6Description: https://datasheet.ciiva.com/2457/pyu-r-int-thick-7-2457019.pdf?src-supplier=Digi-Key; ComponentLink7URL: https://datasheet.ciiva.com/2457/pyu-r-int-thick-7-2457017.pdf?src-supplier=Digi-Key; ComponentLink7Description: https://datasheet.ciiva.com/2457/pyu-r-int-thick-7-2457017.pdf?src-supplier=Digi-Key; ComponentLink8URL: https://datasheet.ciiva.com/12667/rc0805-12667001.pdf?src-supplier=Mouser; ComponentLink8Description: https://datasheet.ciiva.com/12667/rc0805-12667001.pdf?src-supplier=Mouser; ComponentLink9URL: https://datasheet.ciiva.com/7941/1697719-7941676.pdf?src-supplier=Element14; ComponentLink9Description: https://datasheet.ciiva.com/7941/1697719-7941676.pdf?src-supplier=Element14; ComponentLink10URL: https://datasheet.ciiva.com/7941/1697719-7941678.pdf?src-supplier=Element14; ComponentLink10Description: https://datasheet.ciiva.com/7941/1697719-7941678.pdf?src-supplier=Element14; ComponentLink11URL: https://datasheet.ciiva.com/16747/rc0805-16747226.pdf?src-supplier=Future+Electronics; ComponentLink11Description: https://datasheet.ciiva.com/16747/rc0805-16747226.pdf?src-supplier=Future+Electronics; Supplier Part Number 1: RC0805FR-07100KL
R22 = RES_10_K_0805: 贴片电阻 10000Ω ± 1.00% 0.125W ± 100ppm/℃ 0805; Manufacturer: Yageo; Manufacturer Part Number: RC0805FR-0710KL; Resistance: 10kR; Tolerance: 1%; Temperature Coefficient: 100ppm/°C; Power Rating: 125mW; Voltage Rating: 150V; Supplier 1: Avnet; RoHS: Yes; Category: Chip SMD Resistors; Stock 1: 725000; Pricing 1: 5000=0.00227, 10000=0.00224, 20000=0.00217 (USD); Case/Package: 0805; Case Code (Imperial): 0805; Case Code (Metric): 2012; Size Code: 0805; Min Operating Temperature: -55°C; Max Operating Temperature: 155°C; Packaging: Tape and Reel; Resistor Type: Thick Film; Package Quantity: 1; Termination: SMD/SMT; Number of Terminations: 2; Max Power Dissipation: 125mW; Features: Moisture Resistant; Series: RC; Construction: Rectangular; Resistance Tolerance: 1%; Technology: THICK FILM; Length: 2mm; Width: 0.049inch; Height: 0.024inch; Depth: 1.25mm; REACH SVHC: Unknown; Lead Free: Lead Free; Military Standard: Not; RoHS Compliant: Yes; Supplier Part Number 1: RC0805FR-0710KL
U1 = NOT GATE 7 Channel: 6-ch, 4.5-V to 5.5-V inverters with Schmitt-Trigger inputs 14-TSSOP -40 to 85; Manufacturer: Texas Instruments; Manufacturer Part Number: SN74ACT14PWR; Max Supply Voltage: 5.5V; Min Supply Voltage: 4.5V; Propagation Delay: 12.5ns; Logic Function: Buffer,Inverter,Schmitt Trigger; Number of Elements: 6; Number of Inputs: 1; Quiescent Current: 2uA; High Level Output Current: -24mA; Low Level Output Current: 24mA; Supplier 1: Digi-Key; RoHS: Yes; Category: Logic Gates; Stock 1: 3394; Pricing 1: 1=0.63000, 10=0.55300, 25=0.51920, 100=0.42370, 250=0.39356, 500=0.33496, 1000=0.26797 (USD); Mount: Surface Mount; Case/Package: TSSOP; Number of Pins: 14; Weight: 0.002018oz; Contact Plating: Gold; Min Operating Temperature: -40°C; Max Operating Temperature: 85°C; Packaging: Tape and Reel; Package Quantity: 2000; Operating Supply Voltage: 5.5V; Turn-On Delay Time: 12.5ns; Output Current: 24mA; Number of Circuits: 6; Number of Gates: 6; Number of Bits: 6; Radiation Hardening: No; Lead Free: Lead Free; RoHS Compliant: Yes; REACH SVHC: No SVHC; ComponentLink1URL: https://datasheet.ciiva.com/15089/getdatasheetpartid-305342-15089581.pdf?src-supplier=Verical; ComponentLink1Description: https://datasheet.ciiva.com/15089/getdatasheetpartid-305342-15089581.pdf?src-supplier=Verical; ComponentLink2URL: https://datasheet.ciiva.com/41456/001016133-da-01-en-ic-hex-schm-tr-sn74act14pwr-tssop-14-tid-41456409.pdf?src-supplier=Conrad; ComponentLink2Description: https://datasheet.ciiva.com/41456/001016133-da-01-en-ic-hex-schm-tr-sn74act14pwr-tssop-14-tid-41456409.pdf?src-supplier=Conrad; ComponentLink3URL: https://datasheet.ciiva.com/1864/sn74act14-1864429.pdf?src-supplier=Digi-Key; ComponentLink3Description: https://datasheet.ciiva.com/1864/sn74act14-1864429.pdf?src-supplier=Digi-Key; ComponentLink4URL: https://datasheet.ciiva.com/1864/sn74act14-1864428.pdf?src-supplier=Digi-Key; ComponentLink4Description: https://datasheet.ciiva.com/1864/sn74act14-1864428.pdf?src-supplier=Digi-Key; ComponentLink5URL: https://datasheet.ciiva.com/1864/sn74act14-1864430.pdf?src-supplier=Digi-Key; ComponentLink5Description: https://datasheet.ciiva.com/1864/sn74act14-1864430.pdf?src-supplier=Digi-Key; ComponentLink6URL: https://datasheet.ciiva.com/14289/sn74act14-14289596.pdf?src-supplier=Avnet; ComponentLink6Description: https://datasheet.ciiva.com/14289/sn74act14-14289596.pdf?src-supplier=Avnet; Supplier Part Number 1: 296-4369-1-ND
U2 = AND 2 INP 1 CKT: Single 2-input, 4.5-V to 5.5-V AND gate with TTL-compatible CMOS inputs 5-SOT-23 -40 to 125; Manufacturer: Texas Instruments; Supplier 1: Digi-Key; Manufacturer Part Number: SN74AHCT1G08DBV3; RoHS: Yes; Category: Logic Gates; Stock 1: 12309; Pricing 1: 1=0.46000, 10=0.37400, 25=0.34200, 100=0.25440, 250=0.23056, 500=0.19080, 1000=0.14310 (USD); Logic Function: AND GATE; RoHS Compliant: Yes; ComponentLink1URL: http://www.ti.com/general/docs/suppproductinfo.tsp?distId=10&amp;gotoUrl=http%3A%2F%2Fwww.ti.com%2Flit%2Fgpn%2FSN74AHCT1G08&src-supplier=Digi-Key; ComponentLink1Description: http://www.ti.com/general/docs/suppproductinfo.tsp?distId=10&amp;gotoUrl=http%3A%2F%2Fwww.ti.com%2Flit%2Fgpn%2FSN74AHCT1G08&src-supplier=Digi-Key; Supplier Part Number 1: 296-SN74AHCT1G08DBV3CT-ND
U3 = AND 4 inp 2 ch SMD: AND Gate IC 2 Channel  14-SOIC; Manufacturer: Texas Instruments; Propagation Delay: 24ns; Number of Circuits: 2; Number of Outputs: 1; Max Supply Voltage: 6V; Min Supply Voltage: 2V; Operating Supply Voltage: 5V; Number of Inputs: 4; Output Current: 25mA; Quiescent Current: 2uA; High Level Output Current: -5.2mA; Low Level Output Current: 5.2mA; Turn-On Delay Time: 28ns; Supplier 1: Arrow Electronics; Manufacturer Part Number: SN74HC21DR; RoHS: Yes; Category: Logic Gates; Stock 1: 216; Pricing 1: 1=0.52890, 10=0.42710, 25=0.39120, 100=0.29110, 250=0.26380, 500=0.21830, 1000=0.16380, 2500=0.15020 (USD); Mount: Surface Mount; Case/Package: SOIC; Number of Pins: 14; Weight: 0.004564oz; Contact Plating: Gold; Min Operating Temperature: -40°C; Max Operating Temperature: 85°C; Packaging: Tape and Reel; Number of Bits: 2; Package Quantity: 1; Logic Function: AND GATE; Number of Gates: 2; Number of Input Lines: 4; Number of Output Lines: 1; Number of Elements: 2; Radiation Hardening: No; Lead Free: Lead Free; RoHS Compliant: Yes; REACH SVHC: No SVHC; ComponentLink1URL: https://datasheet.ciiva.com/1865/sn74hc21-1865190.pdf?src-supplier=Digi-Key; ComponentLink1Description: https://datasheet.ciiva.com/1865/sn74hc21-1865190.pdf?src-supplier=Digi-Key; ComponentLink2URL: https://datasheet.ciiva.com/1865/sn74hc21-1865189.pdf?src-supplier=Digi-Key; ComponentLink2Description: https://datasheet.ciiva.com/1865/sn74hc21-1865189.pdf?src-supplier=Digi-Key; ComponentLink3URL: https://datasheet.ciiva.com/1865/sn74hc21-1865191.pdf?src-supplier=Digi-Key; ComponentLink3Description: https://datasheet.ciiva.com/1865/sn74hc21-1865191.pdf?src-supplier=Digi-Key; ComponentLink4URL: https://datasheet.ciiva.com/14291/sn54hc21-14291336.pdf?src-supplier=Avnet; ComponentLink4Description: https://datasheet.ciiva.com/14291/sn54hc21-14291336.pdf?src-supplier=Avnet; ComponentLink5URL: https://datasheet.ciiva.com/48702/001073280-da-01-en-ic-dual-4in-pos-a-sn74hc21dr-soic-14-tid-48702981.pdf?src-supplier=Conrad; ComponentLink5Description: https://datasheet.ciiva.com/48702/001073280-da-01-en-ic-dual-4in-pos-a-sn74hc21dr-soic-14-tid-48702981.pdf?src-supplier=Conrad; Supplier Part Number 1: SN74HC21DR
U4 = COUNTER CD4516BNSR: CMOS Presettable Binary Up/Down Counter 16-SO -55 to 125; Manufacturer: Texas Instruments; Number of Elements: 1; Direction: Bidirectional; Max Supply Voltage: 18V; Min Supply Voltage: 3V; Propagation Delay: 640ns; Number of Bits: 4; Reset: Asynchronous; Frequency: 11MHz; Sync/Async: Synchronous; Clock Edge Trigger Type: Positive Edge; Quiescent Current: 100uA; Supplier 1: Digi-Key; Manufacturer Part Number: CD4516BNSR; RoHS: Yes; Category: Counters; Stock 1: 10527; Pricing 1: 1=0.59000, 10=0.50500, 25=0.47120, 100=0.37690, 250=0.35000, 500=0.29616, 1000=0.22885 (USD); Mount: Surface Mount; Case/Package: SOP; Number of Pins: 16; Weight: 0.007079oz; Contact Plating: Gold; Min Operating Temperature: -55°C; Max Operating Temperature: 125°C; Packaging: Tape and Reel; Package Quantity: 2000; Number of Bits per Element: 4; Logic Function: Counter; Series: 4000B; Technology: CMOS; Turn-On Delay Time: 640ns; Radiation Hardening: No; Lead Free: Lead Free; RoHS Compliant: Yes; ComponentLink1URL: https://datasheet.ciiva.com/15093/getdatasheetpartid-321652-15093806.pdf?src-supplier=Verical; ComponentLink1Description: https://datasheet.ciiva.com/15093/getdatasheetpartid-321652-15093806.pdf?src-supplier=Verical; ComponentLink2URL: https://datasheet.ciiva.com/1848/cd4516b-1848472.pdf?src-supplier=Digi-Key; ComponentLink2Description: https://datasheet.ciiva.com/1848/cd4516b-1848472.pdf?src-supplier=Digi-Key; ComponentLink3URL: https://datasheet.ciiva.com/1848/cd4510b-1848471.pdf?src-supplier=Digi-Key; ComponentLink3Description: https://datasheet.ciiva.com/1848/cd4510b-1848471.pdf?src-supplier=Digi-Key; ComponentLink4URL: https://datasheet.ciiva.com/1848/cd4516b-1848473.pdf?src-supplier=Digi-Key; ComponentLink4Description: https://datasheet.ciiva.com/1848/cd4516b-1848473.pdf?src-supplier=Digi-Key; ComponentLink5URL: https://datasheet.ciiva.com/14295/cd4516b-14295800.pdf?src-supplier=Avnet; ComponentLink5Description: https://datasheet.ciiva.com/14295/cd4516b-14295800.pdf?src-supplier=Avnet; Supplier Part Number 1: 296-29362-1-ND
U5 = JK Flipflop: Flip Flop JK-Type Pos-Edge 1-Element 8-Pin TSSOP T/R; Manufacturer: ON Semiconductor; Propagation Delay: 0.49ns; Max Supply Voltage: 5.5V; Min Supply Voltage: 3V; Number of Elements: 1; Logic Function: Flip-Flop,JK-Type; Clock Edge Trigger Type: Positive Edge; Polarity: Non-Inverting; Low Level Output Current: 50mA; Turn-On Delay Time: 410ps; High Level Output Current: -50mA; Frequency: 3GHz; Input Type: SINGLE-ENDED; Supplier 1: Mouser; Manufacturer Part Number: MC10EP35DTR2G; RoHS: Yes; Category: Latches and Flip Flops; Mount: Surface Mount; Case/Package: TSSOP; Number of Pins: 8; Min Operating Temperature: -40°C; Max Operating Temperature: 85°C; Packaging: Tape and Reel; Package Quantity: 2500; Number of Circuits: 1; Number of Input Lines: 1; Number of Output Lines: 1; Number of Bits per Element: 1; Number of Bits: 1; Series: 10EP; Technology: ECL; Lead Free: Lead Free; Halogen Free: Halogen Free; RoHS Compliant: Yes; ComponentLink1URL: https://datasheet.ciiva.com/1860/mc10ep35-d-1860067.pdf?src-supplier=Digi-Key; ComponentLink1Description: https://datasheet.ciiva.com/1860/mc10ep35-d-1860067.pdf?src-supplier=Digi-Key; ComponentLink2URL: https://datasheet.ciiva.com/8280/mc10ep35-d-8280233.pdf?src-supplier=Avnet; ComponentLink2Description: https://datasheet.ciiva.com/8280/mc10ep35-d-8280233.pdf?src-supplier=Avnet; Supplier Part Number 1: 863-MC10EP35DTR2G
U6 = Triac: TRIAC Standard 600V 16A Through Hole TO-220AB
U7 = 4N26XSM: DC-IN 1-CH Transistor With Base DC-OUT 6-Pin PDIP SMD; Manufacturer: Isocom; Number of Channels: 1; Output Voltage: 30V; Isolation Voltage: 5.3kV; Input Current: 10mA; Input Type: DC; Output Current per Channel: 50mA; Forward Voltage: 1.2V; Collector-emitter Voltage-Max: 500mV; Supplier 1: RSComponents; Manufacturer Part Number: 4N26XSM; RoHS: Yes; Category: Optocouplers; Mount: Surface Mount; Case/Package: SMD/SMT; Number of Pins: 6; Min Operating Temperature: -55°C; Max Operating Temperature: 100°C; Series: -; Packaging: Rail/Tube; Max Output Voltage: 30V; RoHS Compliant: Yes; REACH SVHC: No SVHC; ComponentLink1URL: https://datasheet.ciiva.com/1249/90919-1249842.pdf?src-supplier=Farnell; ComponentLink1Description: https://datasheet.ciiva.com/1249/90919-1249842.pdf?src-supplier=Farnell; ComponentLink2URL: https://datasheet.ciiva.com/1246/90919-1246996.pdf?src-supplier=Element14; ComponentLink2Description: https://datasheet.ciiva.com/1246/90919-1246996.pdf?src-supplier=Element14; Supplier Part Number 1: 1712953